# EAGLE design Tesla (EAGLE 9.6.2)
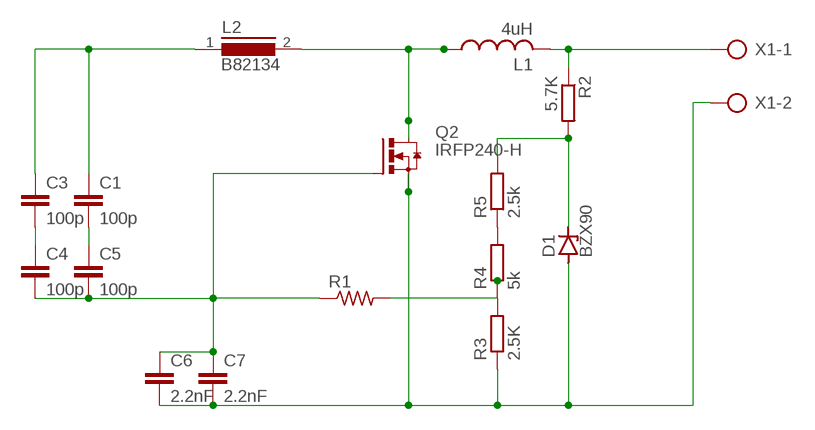
[diagram p0: schematic, sheet 1]

## Parts
C1  100p  C15/5  [C15B5]
C3  100p  C15/5  [C15B5]
C4  100p  C15/5  [C15B5]
C5  100p  C15/5  [C15B5]
C6  2.2nF  C15/5  [C15B5]
C7  2.2nF  C15/5  [C15B5]
D1  BZX90  [DO34Z7]
L1  4uH  L-USTFI0510  [TFI0510]
L2  B82134  [SUKW4-32]
Q2  IRFP240-H  [TO247BH]
R1  R-US_0309/12  [0309/12]
R2  5.7K  R-EU_0204/7  [0204/7]
R3  2.5K  R-EU_0204/7  [0204/7]
R4  5k  R-EU_0204/7  [0204/7]
R5  2.5k  R-EU_0204/7  [0204/7]
X1  AK300/2  [AK300/2]

## Nets
GND: C6.2 C7.2 D1.A Q2.S R3.1 X1.2
N$1: L1.2 R2.1 X1.1
N$2: R4.2 R5.1
N$5: C1.1 C3.1 L2.1
N$6: C3.2 C4.1
N$7: C1.2 C5.1
N$12: L1.1 L2.2 Q2.D
N$13: D1.C R2.2 R5.2
N$14: R1.2 R3.2 R4.1
N$15: C4.2 C5.2 C6.1 C7.1 Q2.G R1.1

## Library data of the parts
C1 C3-C7 = capacitor-wima:C: CAPACITOR naming: grid - package width
D1 = diode:BZX90: Z DIODE
L1 = rcl:L-US: INDUCTOR, American symbol; SPICEPREFIX: L
L2 = inductors:B82134: INDUCTOR; SPICEPREFIX: L
Q2 = transistor-power:IRFP240: HEXFET Power MosFet Source: http://www.irf.com/
R1 = rcl:R-US_: RESISTOR, American symbol; SPICEPREFIX: R
R2-R5 = rcl:R-EU_: RESISTOR, European symbol; SPICEPREFIX: R
X1 = con-ptr500:AK300/2: CONNECTOR; OC_FARNELL: unknown; OC_NEWARK: unknown

## Board
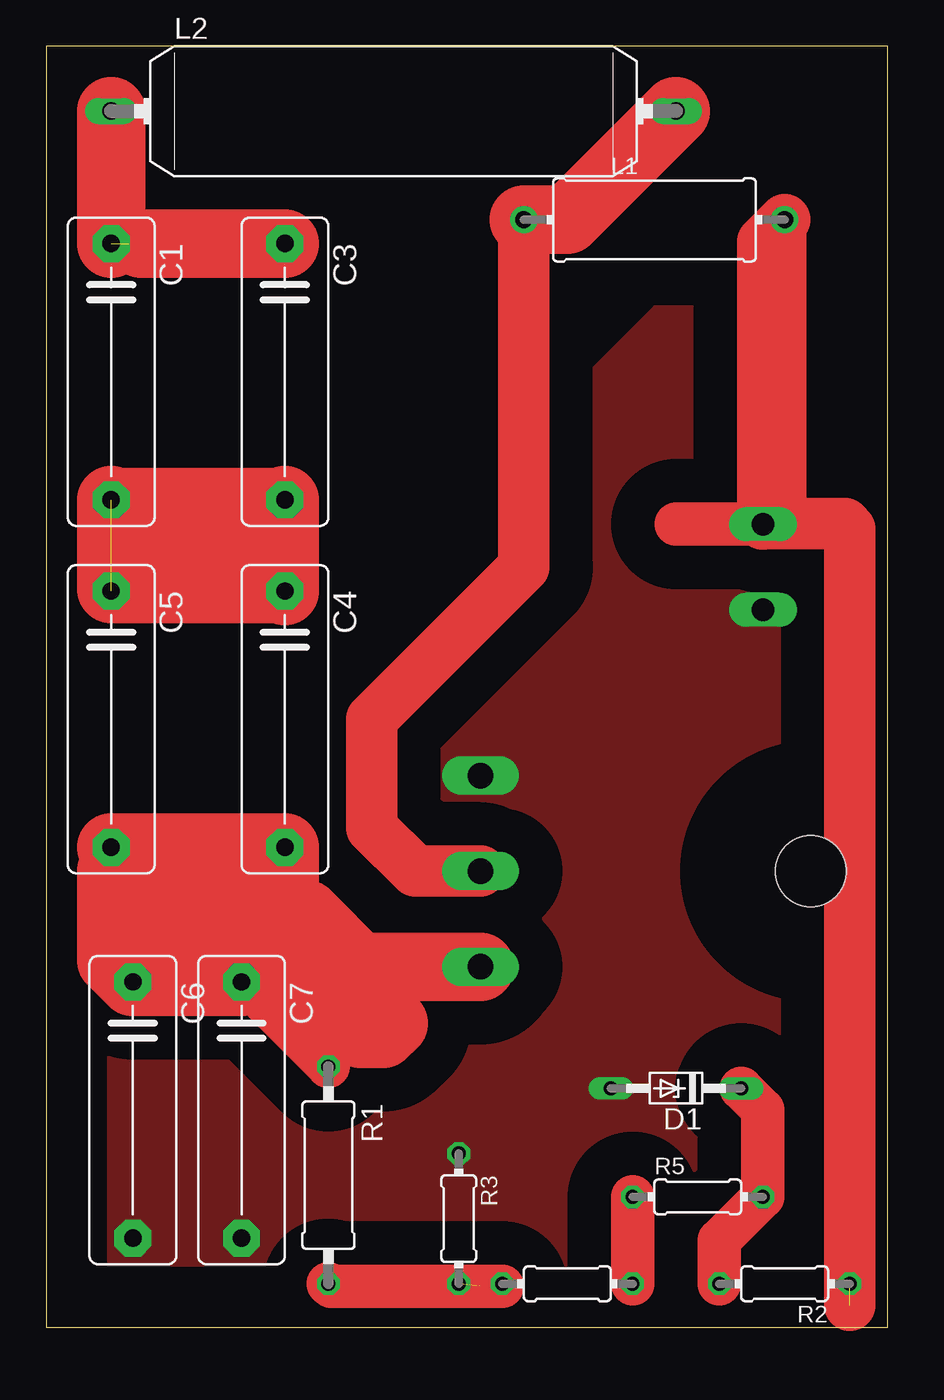
[diagram p1: board, top side]
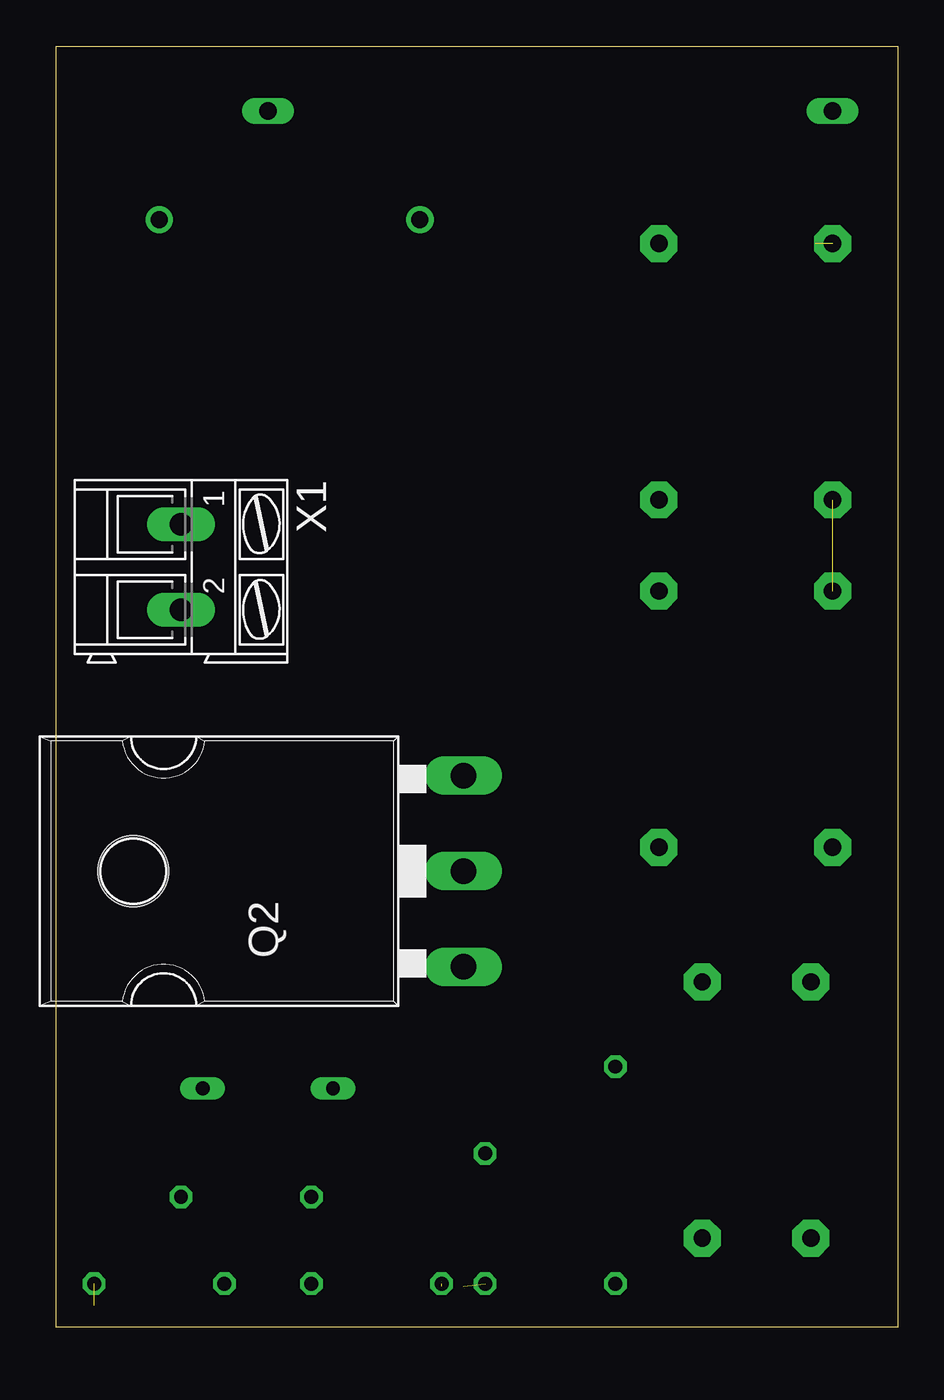
[diagram p2: board, bottom side, seen from below]

Size 49.2 x 74.92 mm. Coordinates in mm from the lower left corner, seen from the top.
Outline: 0,0 49.2,0 49.2,74.92 0,74.92 0,0
Copper layers (1*16): Top 0.035mm / dielectric 1.5mm / Bottom 0.035mm
Design rules "default *": minimum track width 6mil, minimum drill 0.35mm, track to track 6mil, track to pad 6mil, pad to pad 6mil, via to via 6mil, smd to smd 6mil, copper to edge 140mil, drill to drill 6mil, minimum pad ring 10mil, minimum via ring 8mil, stop-mask expansion 4mil, vias tented up to drill 0mil, thermal gap 10mil

### Footprints (pad centres in the part's own frame; a part is rotated, then mirrored left to right if it is on the bottom)
C15B5 = drill 1.016 pad 2.159 octagon: 1 -7.493,0; 2 7.493,0
DO34Z7 = drill 0.813 long: A 3.81,0; C -3.81,0
TFI0510 = drill 1 pad 1.6: 1 -7.62,0; 2 7.62,0
SUKW4-32 = drill 1.016 long: 1 -16.51,0; 2 16.51,0
TO247BH = drill 1.499 long: D 0,-10.16; G -5.588,-10.16; S 5.588,-10.16 | hole 4.115: 0,9.144
0309/12 = drill 0.813 octagon: 1 -6.35,0; 2 6.35,0
0204/7 = drill 0.813 octagon: 1 -3.81,0; 2 3.81,0
AK300/2 = drill 1.321 long: 1 -2.515,0; 2 2.489,0

### Placement (x,y rotation side)
C1  3.81,55.88 270 top
C3  13.97,55.88 270 top
C4  13.97,35.56 270 top
C5  3.81,35.56 270 top
C6  5.08,12.7 270 top
C7  11.43,12.7 270 top
D1  36.83,13.97 180 top
L1  35.56,64.77 0 top
L2  20.32,71.12 0 top
Q2  35.56,26.67 90 bottom
R1  16.51,8.89 270 top
R2  43.18,2.54 180 top
R3  24.13,6.35 270 top
R4  30.48,2.54 0 top
R5  38.1,7.62 0 top
X1  41.91,44.45 270 bottom

### Tracks (layer width: path | path; a pad name or v marks a point on that pad's centre or on a via)
GND
  pour Top (isolate 2.54, no thermals): 50.8,59.69 35.56,59.69 20.32,44.45 20.32,39.37 13.97,33.02 -2.54,33.02 -2.54,0 -1.27,-1.27 50.8,-1.27
N$1  (1 unrouted)
  Top 1.8: 46.99,46.99 R2.1 | 43.19,48.25 43.19,52.06 43.18,52.07
  Top 2.54: L1.2 43.18,52.07 43.18,48.23 X1.1 36.86,46.97
  Top 3: L1.2 41.91,63.5 X1.1 41.94,46.99 46.68,46.99 46.99,46.68 46.99,1.27
N$2
  Top 2.54: R4.2 R5.1
N$5  (1 unrouted)
  Top 2.54: 5.56,63.37 4.83,63.37
  Top 4: C3.1 5.56,63.37 | L2.1 C1.1
N$6
  Top 2.54: C3.2 13.97,43.18
  Top 4: C4.1 C3.2 11.3,45.72 5.08,45.72
N$7  (1 unrouted)
  Top 4: C1.2 3.81,48.26 | 3.81,48.26 3.81,43.18 13.97,43.18 13.97,48.26 3.81,48.26
N$12
  Top 3: Q2.D 21.59,26.67 19.05,29.21 19.05,35.56 27.94,44.45 L1.1
  Top 4: L2.2 30.48,64.77 L1.1
N$13
  Top 2.54: D1.C 41.91,12.7 R5.2 39.37,5.08 R2.2
N$14  (2 unrouted)
  Top 1.8: R4.1 26.52,2.39 25.4,2.39
  Top 2.54: R1.2 16.66,2.39 26.67,2.39
N$15
  Top 2: 13.97,22.86 13.97,25.4
  Top 2.54: C7.1 11.56,20.19 R1.1 | C4.2 13.97,25.4 13.97,24.26
  Top 4: C5.2 8.89,28.07 | 8.89,28.07 C4.2 13.97,22.73 C7.1 | C7.1 5.56,20.19 | 5.56,20.19 C6.1 | Q2.G 18.29,21.08 | 18.29,21.08 12.32,21.08 C7.1 | C6.1 3.81,21.46 3.81,26.67 | C6.1 9.02,24.13 12.7,24.13 12.7,21.59 5.56,21.59 | 5.56,21.59 5.56,26.67 | 5.56,21.59 5.56,20.19 | 8.89,28.07 8.89,24.92 5.56,21.59 | 18.29,21.08 15.24,24.13 13.34,22.23 18.41,17.14 19.69,17.14 20.32,17.78